# EAGLE schematic Valve Board (EAGLE 6.2)
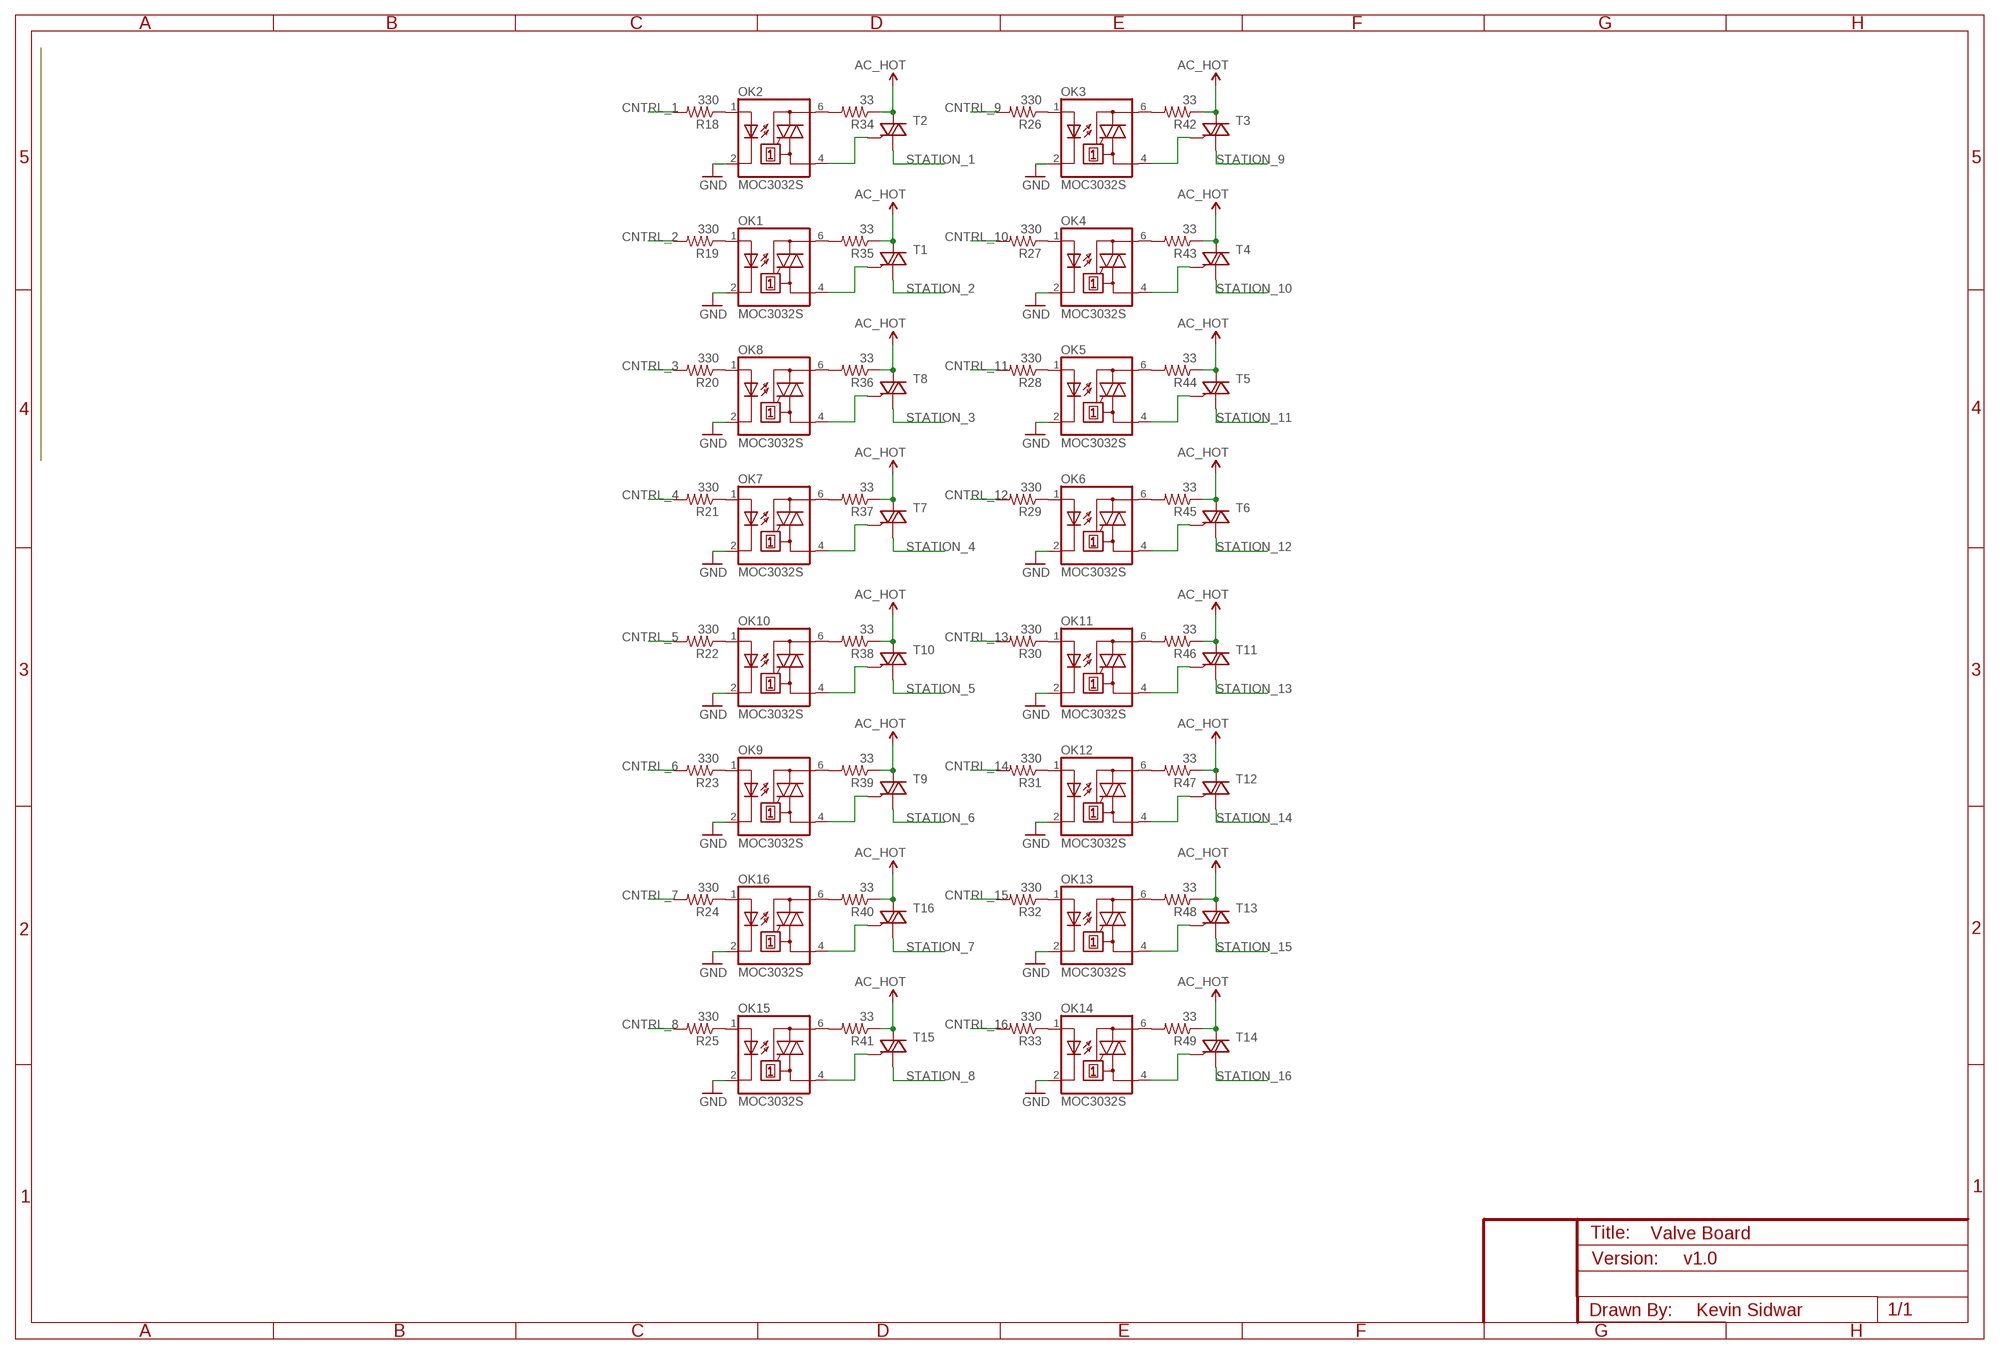
[diagram p0: schematic, sheet 1]

## Parts
OK1  MOC3032S  [DIL6-SMD]
OK2  MOC3032S  [DIL6-SMD]
OK3  MOC3032S  [DIL6-SMD]
OK4  MOC3032S  [DIL6-SMD]
OK5  MOC3032S  [DIL6-SMD]
OK6  MOC3032S  [DIL6-SMD]
OK7  MOC3032S  [DIL6-SMD]
OK8  MOC3032S  [DIL6-SMD]
OK9  MOC3032S  [DIL6-SMD]
OK10  MOC3032S  [DIL6-SMD]
OK11  MOC3032S  [DIL6-SMD]
OK12  MOC3032S  [DIL6-SMD]
OK13  MOC3032S  [DIL6-SMD]
OK14  MOC3032S  [DIL6-SMD]
OK15  MOC3032S  [DIL6-SMD]
OK16  MOC3032S  [DIL6-SMD]
R18  330  RESISTOR0603-RES  [0603-RES]
R19  330  RESISTOR0603-RES  [0603-RES]
R20  330  RESISTOR0603-RES  [0603-RES]
R21  330  RESISTOR0603-RES  [0603-RES]
R22  330  RESISTOR0603-RES  [0603-RES]
R23  330  RESISTOR0603-RES  [0603-RES]
R24  330  RESISTOR0603-RES  [0603-RES]
R25  330  RESISTOR0603-RES  [0603-RES]
R26  330  RESISTOR0603-RES  [0603-RES]
R27  330  RESISTOR0603-RES  [0603-RES]
R28  330  RESISTOR0603-RES  [0603-RES]
R29  330  RESISTOR0603-RES  [0603-RES]
R30  330  RESISTOR0603-RES  [0603-RES]
R31  330  RESISTOR0603-RES  [0603-RES]
R32  330  RESISTOR0603-RES  [0603-RES]
R33  330  RESISTOR0603-RES  [0603-RES]
R34  33  RESISTOR0603-RES  [0603-RES]
R35  33  RESISTOR0603-RES  [0603-RES]
R36  33  RESISTOR0603-RES  [0603-RES]
R37  33  RESISTOR0603-RES  [0603-RES]
R38  33  RESISTOR0603-RES  [0603-RES]
R39  33  RESISTOR0603-RES  [0603-RES]
R40  33  RESISTOR0603-RES  [0603-RES]
R41  33  RESISTOR0603-RES  [0603-RES]
R42  33  RESISTOR0603-RES  [0603-RES]
R43  33  RESISTOR0603-RES  [0603-RES]
R44  33  RESISTOR0603-RES  [0603-RES]
R45  33  RESISTOR0603-RES  [0603-RES]
R46  33  RESISTOR0603-RES  [0603-RES]
R47  33  RESISTOR0603-RES  [0603-RES]
R48  33  RESISTOR0603-RES  [0603-RES]
R49  33  RESISTOR0603-RES  [0603-RES]
T1  LF-TRIACSOT223  [SOT223]
T2  LF-TRIACSOT223  [SOT223]
T3  LF-TRIACSOT223  [SOT223]
T4  LF-TRIACSOT223  [SOT223]
T5  LF-TRIACSOT223  [SOT223]
T6  LF-TRIACSOT223  [SOT223]
T7  LF-TRIACSOT223  [SOT223]
T8  LF-TRIACSOT223  [SOT223]
T9  LF-TRIACSOT223  [SOT223]
T10  LF-TRIACSOT223  [SOT223]
T11  LF-TRIACSOT223  [SOT223]
T12  LF-TRIACSOT223  [SOT223]
T13  LF-TRIACSOT223  [SOT223]
T14  LF-TRIACSOT223  [SOT223]
T15  LF-TRIACSOT223  [SOT223]
T16  LF-TRIACSOT223  [SOT223]

## Nets
AC_HOT: R34.1 R35.1 R36.1 R37.1 R38.1 R39.1 R40.1 R41.1 R42.1 R43.1 R44.1 R45.1 R46.1 R47.1 R48.1 R49.1 T1.2(A2) T2.2(A2) T3.2(A2) T4.2(A2) T5.2(A2) T6.2(A2) T7.2(A2) T8.2(A2) T9.2(A2) T10.2(A2) T11.2(A2) T12.2(A2) T13.2(A2) T14.2(A2) T15.2(A2) T16.2(A2)
CNTRL_1: R18.2
CNTRL_2: R19.2
CNTRL_3: R20.2
CNTRL_4: R21.2
CNTRL_5: R22.2
CNTRL_6: R23.2
CNTRL_7: R24.2
CNTRL_8: R25.2
CNTRL_9: R26.2
CNTRL_10: R27.2
CNTRL_11: R28.2
CNTRL_12: R29.2
CNTRL_13: R30.2
CNTRL_14: R31.2
CNTRL_15: R32.2
CNTRL_16: R33.2
GND: OK1.2(C) OK2.2(C) OK3.2(C) OK4.2(C) OK5.2(C) OK6.2(C) OK7.2(C) OK8.2(C) OK9.2(C) OK10.2(C) OK11.2(C) OK12.2(C) OK13.2(C) OK14.2(C) OK15.2(C) OK16.2(C)
N$1: OK9.1(A) R23.1
N$2: OK1.1(A) R19.1
N$6: OK1.6(A2) R35.2
N$7: OK9.6(A2) R39.2
N$8: OK1.4(A1) T1.3(G)
N$9: OK2.1(A) R18.1
N$12: OK2.6(A2) R34.2
N$13: OK9.4(A1) T9.3(G)
N$14: OK2.4(A1) T2.3(G)
N$17: OK3.1(A) R26.1
N$18: OK3.6(A2) R42.2
N$21: OK3.4(A1) T3.3(G)
N$26: OK4.1(A) R27.1
N$27: OK4.6(A2) R43.2
N$28: OK10.1(A) R22.1
N$29: OK4.4(A1) T4.3(G)
N$32: OK5.1(A) R28.1
N$33: OK5.6(A2) R44.2
N$34: OK10.6(A2) R38.2
N$36: OK5.4(A1) T5.3(G)
N$39: OK6.1(A) R29.1
N$40: OK6.6(A2) R45.2
N$41: OK10.4(A1) T10.3(G)
N$42: OK6.4(A1) T6.3(G)
N$45: OK7.1(A) R21.1
N$46: OK7.6(A2) R37.2
N$48: OK7.4(A1) T7.3(G)
N$51: OK8.1(A) R20.1
N$52: OK8.6(A2) R36.2
N$53: OK11.1(A) R30.1
N$54: OK8.4(A1) T8.3(G)
N$57: OK11.6(A2) R46.2
N$58: OK11.4(A1) T11.3(G)
N$61: OK12.1(A) R31.1
N$62: OK12.6(A2) R47.2
N$63: OK12.4(A1) T12.3(G)
N$66: OK13.1(A) R32.1
N$67: OK13.6(A2) R48.2
N$68: OK13.4(A1) T13.3(G)
N$71: OK14.1(A) R33.1
N$72: OK14.6(A2) R49.2
N$73: OK14.4(A1) T14.3(G)
N$76: OK15.1(A) R25.1
N$77: OK15.6(A2) R41.2
N$78: OK15.4(A1) T15.3(G)
N$81: OK16.1(A) R24.1
N$82: OK16.6(A2) R40.2
N$83: OK16.4(A1) T16.3(G)
STATION_1: T2.1(A1)
STATION_2: T1.1(A1)
STATION_3: T8.1(A1)
STATION_4: T7.1(A1)
STATION_5: T10.1(A1)
STATION_6: T9.1(A1)
STATION_7: T16.1(A1)
STATION_8: T15.1(A1)
STATION_9: T3.1(A1)
STATION_10: T4.1(A1)
STATION_11: T5.1(A1)
STATION_12: T6.1(A1)
STATION_13: T11.1(A1)
STATION_14: T12.1(A1)
STATION_15: T13.1(A1)
STATION_16: T14.1(A1)

## Notes on the sheet
- v1.0
- Kevin Sidwar

## Library data of the parts
OK1-OK16 = lizardworx:MOC30*: 6-Pin DIP Zero-Cross Optoisolators Triac Driver Output (250/400 Volt Peak) Source: http://www.fairchildsemi.com/ds/MO/MOC3043-M.pdf; MF: FAIRCHILD SEMICONDUCTOR; MPN: MOC3032S-M; OC_FARNELL: unknown; OC_NEWARK: 05C2871
R18-R49 = SparkFun-Passives:RESISTOR: Resistor Basic schematic elements and footprints for 0603, 1206, and PTH resistors.
T1-T16 = lizardworx:LF-TRIAC: TRIAC Source: http://www.semiconductors.philips.com BT138_SERIES_2.pdf